# Altium schematic sheet Connectors.SchDoc
size A4; CompanyName: Technische Hochschule Nürnberg Georg Simon Ohm; Organization: UltraZohm; Address1: Kesslerplatz 12; Address2: 90489 Nürnberg; Address3: GERMANY; Website: www.ultrazohm.com
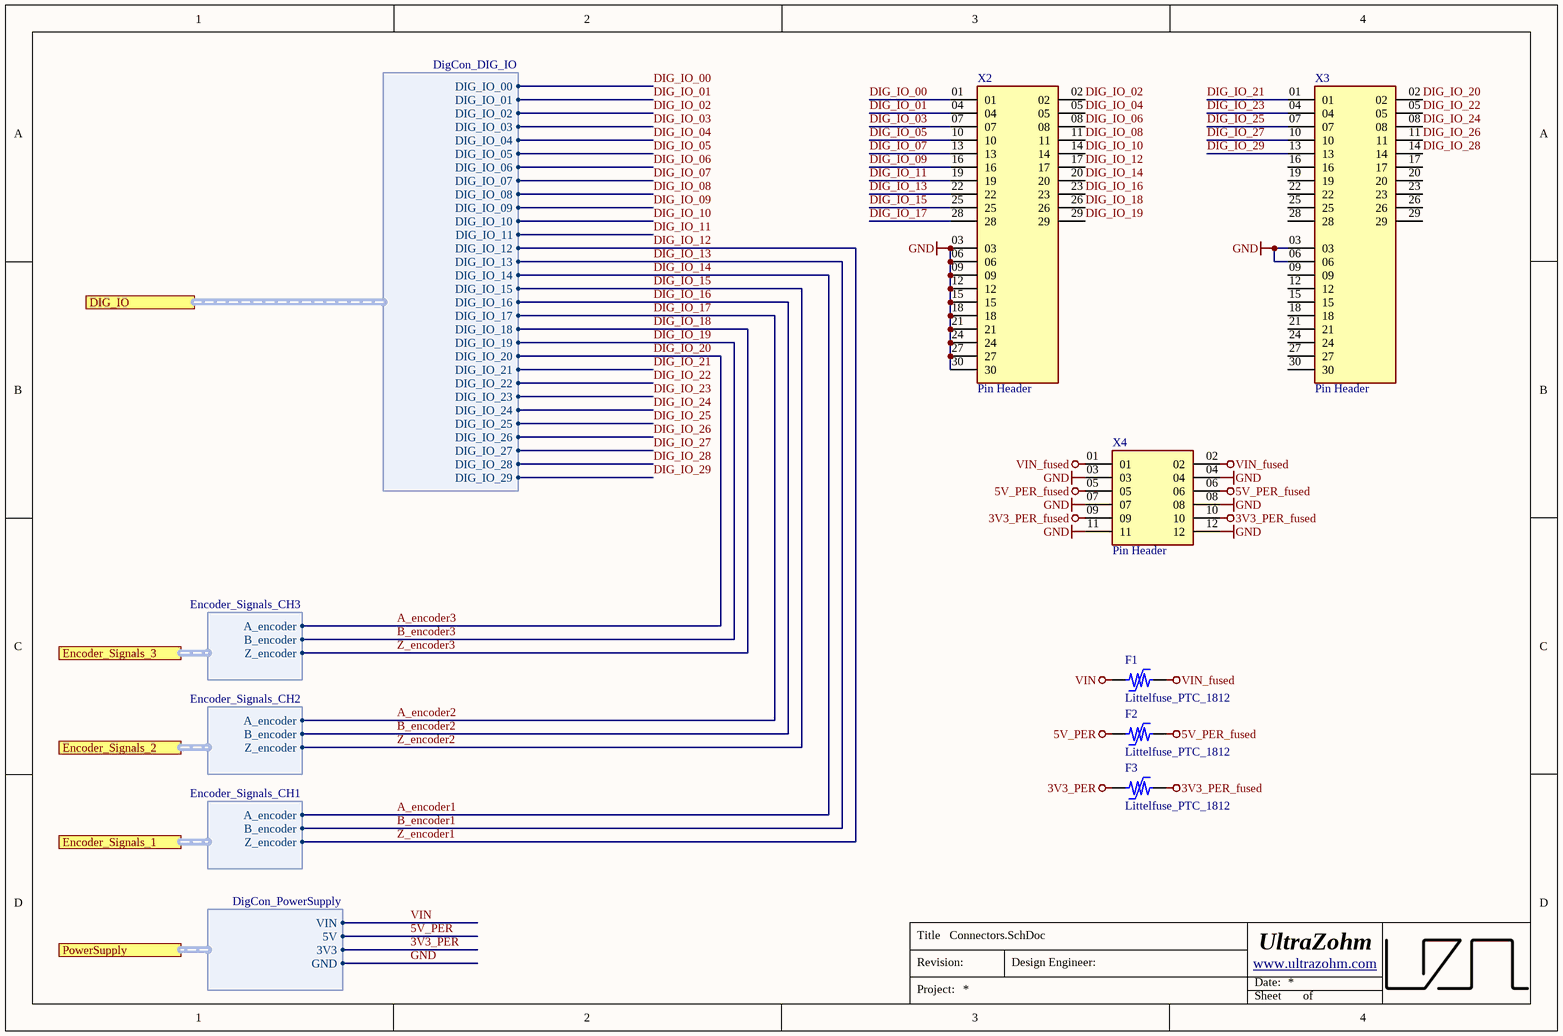
[diagram p0: Connectors.SchDoc]

## Parts
F1  Littelfuse_PTC_1812  [1812_PTC_Polyfuse_Littelfuse]
F2  Littelfuse_PTC_1812  [1812_PTC_Polyfuse_Littelfuse]
F3  Littelfuse_PTC_1812  [1812_PTC_Polyfuse_Littelfuse]
X2  Pin Header  [SAMTEC_TSW-110-07-F-T]
X3  Pin Header  [SAMTEC_TSW-110-07-F-T]
X4  Pin Header  [SAMTEC_TSW-106-07-F-D]

## Ports
DIG_IO (harness DigCon_DIG_IO), Encoder_Signals_1 (harness Encoder_Signals_CH1), Encoder_Signals_2 (harness Encoder_Signals_CH2), Encoder_Signals_3 (harness Encoder_Signals_CH3), PowerSupply (harness DigCon_PowerSupply)

## Harnesses
Encoder_Signals_CH3: A_encoder, B_encoder, Z_encoder
Encoder_Signals_CH2: A_encoder, B_encoder, Z_encoder
Encoder_Signals_CH1: A_encoder, B_encoder, Z_encoder
DigCon_DIG_IO: DIG_IO_01, DIG_IO_02, DIG_IO_03, DIG_IO_04, DIG_IO_05, DIG_IO_06, DIG_IO_07, DIG_IO_08, DIG_IO_09, DIG_IO_10, DIG_IO_11, DIG_IO_12, DIG_IO_13, DIG_IO_14, DIG_IO_15, DIG_IO_16, DIG_IO_17, DIG_IO_18, DIG_IO_19, DIG_IO_20, DIG_IO_21, DIG_IO_22, DIG_IO_23, DIG_IO_24, DIG_IO_25, DIG_IO_26, DIG_IO_27, DIG_IO_28, DIG_IO_29, DIG_IO_00
DigCon_PowerSupply: GND, 3V3, 5V, VIN

## Nets
3V3_PER: F3.1 ; port PowerSupply.3V3
3V3_PER_fused: F3.2 X4.09 X4.10
5V_PER: F2.1 ; port PowerSupply.5V
5V_PER_fused: F2.2 X4.05 X4.06
GND: X2.03 X2.06 X2.09 X2.12 X2.15 X2.18 X2.21 X2.24 X2.27 X2.30 X3.03 X3.06 X4.03 X4.04 X4.07 X4.08 X4.11 X4.12 ; port PowerSupply.GND
VIN: F1.1 ; port PowerSupply.VIN
VIN_fused: F1.2 X4.01 X4.02
A_encoder1: X2.20 ; port Encoder_Signals_1.A_encoder, port DIG_IO.DIG_IO_14  [also labelled DIG_IO_14]
A_encoder2: X2.28 ; port Encoder_Signals_2.A_encoder, port DIG_IO.DIG_IO_17  [also labelled DIG_IO_17]
A_encoder3: X3.02 ; port Encoder_Signals_3.A_encoder, port DIG_IO.DIG_IO_20  [also labelled DIG_IO_20]
B_encoder1: X2.22 ; port Encoder_Signals_1.B_encoder, port DIG_IO.DIG_IO_13  [also labelled DIG_IO_13]
B_encoder2: X2.23 ; port Encoder_Signals_2.B_encoder, port DIG_IO.DIG_IO_16  [also labelled DIG_IO_16]
B_encoder3: X2.29 ; port Encoder_Signals_3.B_encoder, port DIG_IO.DIG_IO_19  [also labelled DIG_IO_19]
DIG_IO_00: X2.01 ; port DIG_IO.DIG_IO_00
DIG_IO_01: X2.04 ; port DIG_IO.DIG_IO_01
DIG_IO_02: X2.02 ; port DIG_IO.DIG_IO_02
DIG_IO_03: X2.07 ; port DIG_IO.DIG_IO_03
DIG_IO_04: X2.05 ; port DIG_IO.DIG_IO_04
DIG_IO_05: X2.10 ; port DIG_IO.DIG_IO_05
DIG_IO_06: X2.08 ; port DIG_IO.DIG_IO_06
DIG_IO_07: X2.13 ; port DIG_IO.DIG_IO_07
DIG_IO_08: X2.11 ; port DIG_IO.DIG_IO_08
DIG_IO_09: X2.16 ; port DIG_IO.DIG_IO_09
DIG_IO_10: X2.14 ; port DIG_IO.DIG_IO_10
DIG_IO_11: X2.19 ; port DIG_IO.DIG_IO_11
DIG_IO_12: X2.17 ; port Encoder_Signals_1.Z_encoder, port DIG_IO.DIG_IO_12  [also labelled Z_encoder1]
DIG_IO_15: X2.25 ; port Encoder_Signals_2.Z_encoder, port DIG_IO.DIG_IO_15  [also labelled Z_encoder2]
DIG_IO_18: X2.26 ; port Encoder_Signals_3.Z_encoder, port DIG_IO.DIG_IO_18  [also labelled Z_encoder3]
DIG_IO_21: X3.01 ; port DIG_IO.DIG_IO_21
DIG_IO_22: X3.05 ; port DIG_IO.DIG_IO_22
DIG_IO_23: X3.04 ; port DIG_IO.DIG_IO_23
DIG_IO_24: X3.08 ; port DIG_IO.DIG_IO_24
DIG_IO_25: X3.07 ; port DIG_IO.DIG_IO_25
DIG_IO_26: X3.11 ; port DIG_IO.DIG_IO_26
DIG_IO_27: X3.10 ; port DIG_IO.DIG_IO_27
DIG_IO_28: X3.14 ; port DIG_IO.DIG_IO_28
DIG_IO_29: X3.13 ; port DIG_IO.DIG_IO_29

Not connected (* = marked no-connect by the designer): X3 09 12 15 16 17 18 19 20 21 22 23 24 25 26 27 28 29 30

## Notes on the sheet
- Title
- Revision:
- Design Engineer:
- Date:
- Project:
- Sheet
- of

## Library data of the parts
F1-F3 = Littelfuse_PTC_1812: POLYSWITCH RESETTABLE DEVICES; MPN: miniASMDC110F/24; Value: PTC, 1.1 A, 24V; Voltage: 24V; Trip Current: 2.2A; Hold Current: 1.1A; Resistance: 0.18 Ohm; Type: Fuse; Nominal current: 1 A; Created from: MHlatky; MF: Littelfuse; Created: 2019_02_10_AGeiger; Package: 1812; ComponentLink1URL: https://www.littelfuse.com/~/media/electronics/datasheets/resettable_ptcs/littelfuse_ptc_surface_mount_catalog_datasheet.pdf.pdf; ComponentLink1Description: Datasheet; Manufacturer Part Number: Littelfuse_PTC_1812; PartID: 5; Created On: 07.05.2021 06:50:33; Component Type: Littelfuse_PTC_1812; Last Updated: 10.03.2022 18:07:30; Manufacturer: Littelfuse; Mounting Type: SMD; Operating Temperature: -40 - 85 °C; Supplier 1: Mouser; Supplier Part Number 1: 530-0ZCG0150BF2C; Live Cycle Status: 1
X2 X3 = TSW-110-07-F-T: THROUGH-HOLE .025" SQ POST HEADER; Manufacturer: SAMTEC; MF: Samtec Inc.; Created from: MHlatky; Value: *; MP: TSW-110-07-F-T; Package: None; Price: None; Availability: Unavailable; Manufacturer Part Number: TSW-110-07-F-T; PartID: 7; Created On: 22.11.2021 15:31:45; ComponentLink1Description: Datasheet; ComponentLink1URL: https://www.mouser.de/datasheet/2/527/tsw_th-2854687.pdf; Component Type: Pin Header; Device Package: THT; Last Updated: 20.12.2021 07:38:08; Mounting Type: THT; Operating Temperature: -55 +125 °C; Series: TSW; Supplier 1: Mouser; Supplier Part Number 1: 200-TSW11007FT; Type: Pin Header; Live Cycle Status: 1; Stock number: not stored
X4 = TSW-106-07-F-D: THROUGH-HOLE .025" SQ POST HEADER; MF: Samtec; Created from: MHlatky; MP: TSW-106-07-F-D; Price: None; Package: None; Value: *; Availability: Unavailable; Manufacturer Part Number: TSW-106-07-F-D; PartID: 8; Created On: 22.11.2021 15:31:45; ComponentLink1Description: Datasheet; ComponentLink1URL: https://www.mouser.de/datasheet/2/527/tsw_th-2854687.pdf; Component Type: Pin Header; Device Package: THT; Last Updated: 20.12.2021 07:38:08; Manufacturer: SAMTEC; Mounting Type: THT; Operating Temperature: -55 +125 °C; Series: TSW; Supplier 1: Mouser; Supplier Part Number 1: 200-TSW10607FD; Type: Pin Header; Live Cycle Status: 1; Stock number: not stored